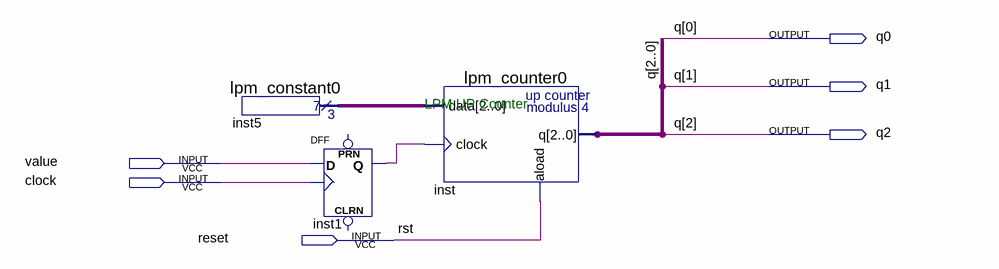
[diagram p0: schematic sheet]
// Quartus schematic LPMCounterwDFF.bdf as structural Verilog: 3 symbols, 6 pins
module LPMCounterwDFF (
  input  value,
  input  clock,
  input  reset,
  output q0,
  output q1,
  output q2
);

  wire inst1_q;
  wire [2:0] inst5_result;

  lpm_constant0 inst5 (.result(inst5_result));
  DFF inst1 (.CLK(clock), .D(value), .Q(inst1_q));  // open: CLRN, PRN
  lpm_counter0 inst (.data(inst5_result), .aload(reset), .clock(inst1_q), .q({q2, q1, q0}));

  // Other names for the same wires on the sheet: rst = reset

  // Notes on the sheet:
  //   LPM UP Counter
endmodule
